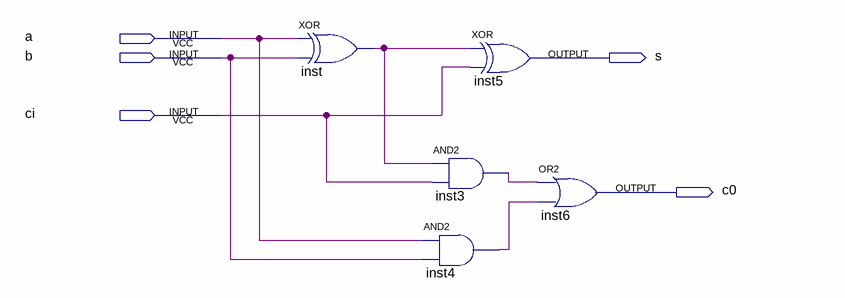
[diagram p0: schematic sheet]
// Quartus schematic full_header.bdf as structural Verilog: 5 symbols, 5 pins
module full_header (
  input  a,
  input  b,
  input  ci,
  output s,
  output c0
);

  wire inst3_out, inst4_out, inst_out;

  xor inst (inst_out, a, b);
  and inst3 (inst3_out, inst_out, ci);
  and inst4 (inst4_out, a, b);
  xor inst5 (s, inst_out, ci);
  or inst6 (c0, inst3_out, inst4_out);
endmodule
